# Altium project Mach_Ve.PrjPcb
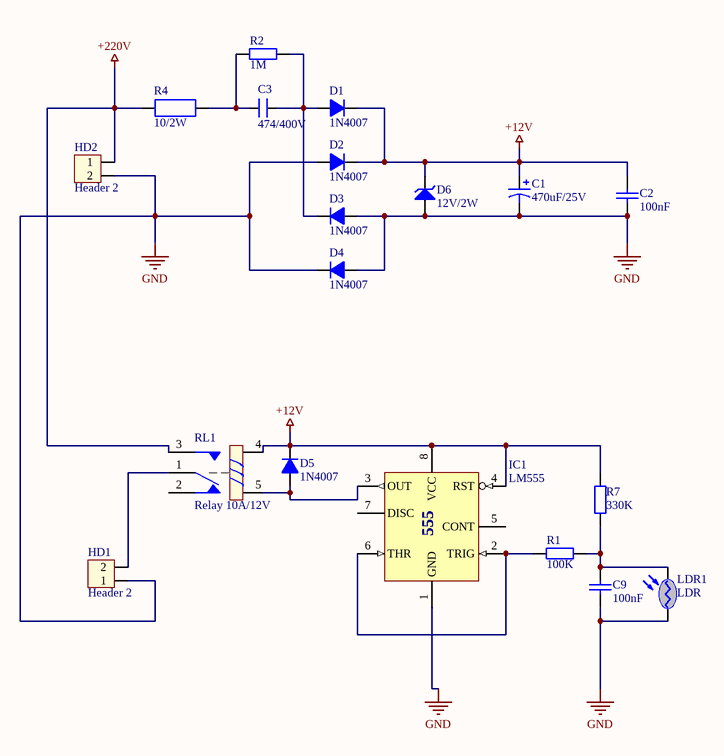
[diagram p0: mach_ve.SchDoc]
1 sheet, 19 parts. Net scope: global (net labels, ports and power ports of the same name join across sheets).
Board file: mach_ve.PcbDoc

## Sheet mach_ve.SchDoc
size A4; SheetNumber: 1; SheetTotal: 1

### Parts
C1  470uF/25V  [C10mm]
C2  value 100nF  [Tu-pico]  (hidden comment: Capacitor Ceramic)
C3  474/400V  [CN4]
C9  value 100nF  [Tu-pico]  (hidden comment: Capacitor Ceramic)
D1  1N4007  [D1A]
D2  1N4007  [D1A]
D3  1N4007  [D1A]
D4  1N4007  [D1A]
D5  1N4007  [D1A]
D6  12V/2W  [DIODE_ZENER]
HD1  Header 2  [HED2]
HD2  Header 2  [HED2]
IC1  LM555  [DIP8/W0.3]
LDR1  LDR  [CDS]
R1  value 100K  [DIEN TRO 1/4 W]  (hidden comment: R0.4W)
R2  value 1M  [DIEN TRO 1/4 W]  (hidden comment: R0.4W)
R4  10/2W  [R2W]
R7  value 330K  [DIEN TRO 1/4 W]  (hidden comment: R0.4W)
RL1  Relay 10A/12V  [RL_SPDT_10A]

### Nets
+12V: C1.1 C2.2 D1.2(K) D2.2(K) D5.2(K) D6.2(K) IC1.4(RST) IC1.8(VCC) R7.2 RL1.4
+220V: HD2.1 R4.1 RL1.3
GND: C1.2 C2.1 C9.1 D2.1(A) D3.1(A) D4.1(A) D4.2(K) D6.1(A) HD1.1 HD2.2 IC1.1(GND) LDR1.1(A)
NetC3_1: C3.1 R2.2 R4.2
NetC3_2: C3.2 D1.1(A) D3.2(K) R2.1
NetC9_2: C9.2 LDR1.2(K) R1.2 R7.1
NetD5_1: D5.1(A) IC1.3(OUT) RL1.5
NetHD1_2: HD1.2 RL1.1
NetIC1_2: IC1.2(TRIG) IC1.6(THR) R1.1

Not connected (* = marked no-connect by the designer): IC1 5(CONT) 7(DISC); RL1 2

### Notes on the sheet
- (in symbol LM555) 555

### Library data of the parts
C1 = Cap Pol 12mm: Polarized Capacitor (Axial); Published: 8-Jun-2000; LatestRevisionDate: 17-Jul-2002; LatestRevisionNote: Re-released for DXP Platform.; PackageReference: POLAR0.8; Publisher: Altium Limited
C2 C9 = CapCeramic: Capacitor; Published: 8-Jun-2000; LatestRevisionDate: 17-Jul-2002; LatestRevisionNote: Re-released for DXP Platform.; PackageReference: RAD-0.3; Publisher: Altium Limited
C3 = CN4: Cap np W0.4; Value: 0.47uF
D1-D5 = D1A: Diode 1A; Value: 1N4007
D6 = Diode Zener: Zener Diode; Published: 8-Jun-2000; LatestRevisionDate: 17-Jul-2002; LatestRevisionNote: Re-released for DXP Platform.; PackageReference: DIODE-0.7; Publisher: Altium Limited
HD1 HD2 = Hed2: Header 2 (Green); Value: Header 2
IC1 = LM555: Timer; Value: LM555
LDR1 = LDR: Quang Tro
R1 R2 R7 = Res 1/4 W: Resistor; Published: 8-Jun-2000; LatestRevisionDate: 17-Jul-2002; LatestRevisionNote: Re-released for DXP Platform.; PackageReference: AXIAL-0.4; Publisher: Altium Limited
R4 = R2W: Resistor 2W; Value: R2W - 47
RL1 = Relay 1: Relay SPDT,10A - 12VDC 5 Pin; Value: Relay SPDT, 10A, 12V